# EAGLE design BT832A (EAGLE 9.6.2)

## Sheet 1 of 3
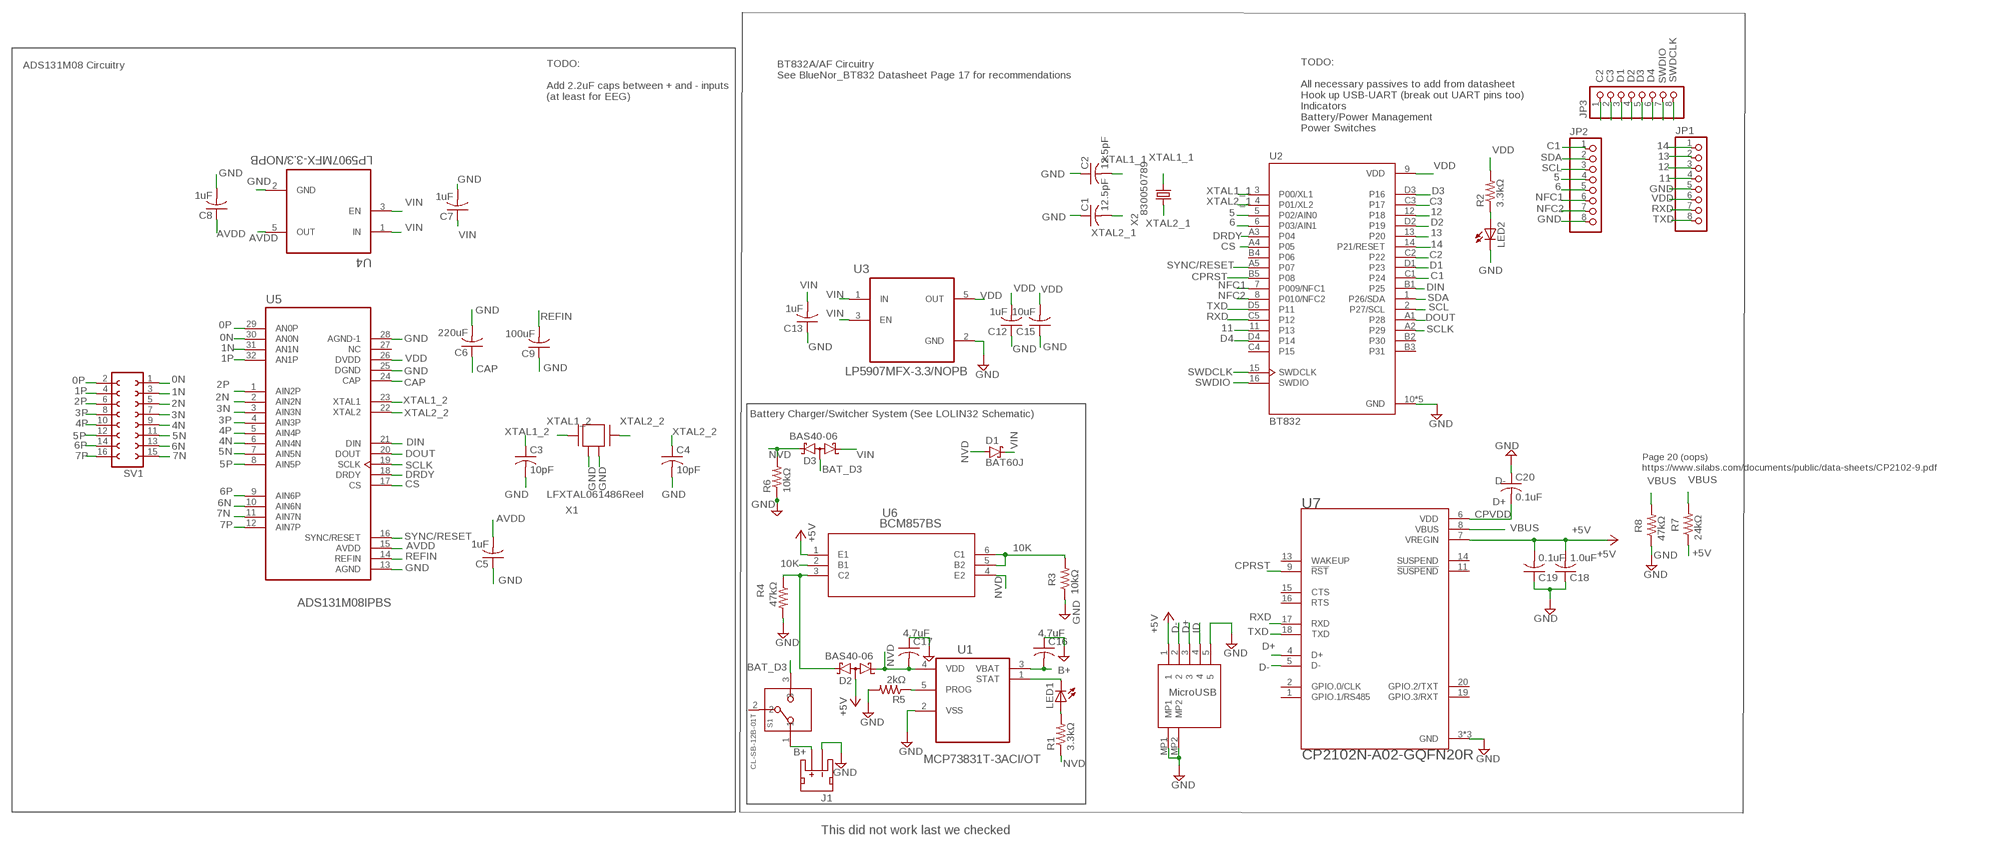
[diagram p0: schematic, sheet 1]

### Parts
C1  12.5pF  C-USC0402  [C0402]
C2  12.5pF  C-USC0402  [C0402]
C3  10pF  C-USC0402  [C0402]
C4  10pF  C-USC0402  [C0402]
C5  1uF  C-USC0402  [C0402]
C6  220uF  C-USC0402  [C0402]
C7  1uF  C-USC0402  [C0402]
C8  1uF  C-USC0402  [C0402]
C9  100uF  C-USC0402  [C0402]
C12  1uF  C-USC0402  [C0402]
C13  1uF  C-USC0402  [C0402]
C15  10uF  C-USC0402  [C0402]
C16  4.7uF  C-USC0402  [C0402]
C17  4.7uF  C-USC0402  [C0402]
C18  1.0uF  C-USC0402  [C0402]
C19  0.1uF  C-USC0402  [C0402]
C20  0.1uF  C-USC0402  [C0402]
D1  BAT60J  [SOD323_ST]
D2  BAS40-06  [SOT23]
D3  BAS40-06  [SOT23]
J1  JST_2MM_MALE  [JST-2-SMD]
JP1  PINHD-1X8CLEANBIG  [1X08-CLEANBIG]
JP2  PINHD-1X8CLEANBIG  [1X08-CLEANBIG]
JP3  PINHD-1X8CLEANBIG  [1X08-CLEANBIG]
LED1  LEDCHIP-LED0603  [CHIP-LED0603]
LED2  LEDCHIP-LED0603  [CHIP-LED0603]
R1  3.3kΩ  R-US_R0402  [R0402]
R2  3.3kΩ  R-US_R0402  [R0402]
R3  10kΩ  R-US_R0402  [R0402]
R4  47kΩ  R-US_R0402  [R0402]
R5  2kΩ  R-US_R0402  [R0402]
R6  10kΩ  R-US_R0402  [R0402]
R7  24kΩ  R-US_R0402  [R0402]
R8  47kΩ  R-US_R0402  [R0402]
S1  CL-SB-12B-01T  [CL-SB-12B]
SV1  FE08-2  [FE08-2]
U1  MCP73831T-3ACI/OT  [SOT95P270X145-5N]
U2  BT832  [BLEMODULE_BT832]
U3  LP5907MFX-3.3/NOPB  [SOT95P280X145-5N]
U4  LP5907MFX-3.3/NOPB  [SOT95P280X145-5N]
U5  ADS131M08IPBS  [QFP50P700X700X120-32N]
U6  BCM857BS  [SOT363_NEX]
U7  CP2102N-A02-GQFN20R  [SILABS_CP2102N-A02-GQFN20R]
U$1  DX4R005JJ2R1800  [DX4R005JJ2R1800]
X1  ABM3B-8.000MHZ-B2-T  [ABM3B-8.000MHZ-B2-T]
X2  FC-12M  [FC-12M]

### Nets
0N: SV1.1 U5.30(AN0N)
0P: SV1.2 U5.29(AN0P)
1N: SV1.3 U5.31(AN1N)
1P: SV1.4 U5.32(AN1P)
2N: SV1.5 U5.2(AIN2N)
2P: SV1.6 U5.1(AIN2P)
3N: SV1.7 U5.3(AIN3N)
3P: SV1.8 U5.4(AIN3P)
4N: SV1.9 U5.6(AIN4N)
4P: SV1.10 U5.5(AIN4P)
5: JP2.4 U2.5(P02/AIN0)
5N: SV1.11 U5.7(AIN5N)
5P: SV1.12 U5.8(AIN5P)
6: JP2.5 U2.6(P03/AIN1)
6N: SV1.13 U5.10(AIN6N)
6P: SV1.14 U5.9(AIN6P)
7N: SV1.15 U5.11(AIN7N)
7P: SV1.16 U5.12(AIN7P)
10K: R3.2 U6.2(B1) U6.5(B2) U6.6(C1)
11: JP1.4 U2.11(P13)
12: JP1.3 U2.12(P18)
13: JP1.2 U2.13(P20)
14: JP1.1 U2.14(P21/RESET)
+5V: C18.2 C19.2 D2.3(AA) R7.1 U6.1(E1) U7.7(VREGIN) U$1.1
AVDD: C5.2 C8.1 U4.5(OUT) U5.15(AVDD)
B+: C16.2 J1.2(+) S1.1 U1.3(VBAT)
BAT_D3: D3.3(AA) S1.3
C1: JP2.1 U2.C1(P24)
C2: JP3.1 U2.C2(P22)
C3: JP3.2 U2.C3(P17)
CAP: C6.1 U5.24(CAP)
CPRST: U2.B5(P08) U7.9(!RST)
CPVDD: C20.2 U7.6(VDD)
CS: U2.A4(P05) U5.17(CS)
D1: JP3.3 U2.D1(P23)
D2: JP3.4 U2.D2(P19)
D3: JP3.5 U2.D3(P16)
D4: JP3.6 U2.D4(P14)
D+: U7.4(D+) U$1.3
D-: U7.5(D-) U$1.2
DIN: U2.B1(P25) U5.21(DIN)
DOUT: U2.A1(P28) U5.20(DOUT)
DRDY: U2.A3(P04) U5.18(DRDY)
GND: C1.1 C2.1 C3.2 C4.2 C5.1 C6.2 C7.2 C8.2 C9.1 C12.1 C13.1 C15.1 C16.1 C17.1 C18.1 C19.1 C20.1 J1.1(-) JP1.5 JP2.8 LED2.C R3.1 R4.2 R5.2 R6.1 R8.1 U1.2(VSS) U2.10(GND) U2.A0(GND) U2.B0(GND) U2.C0(GND) U2.D0(GND) U3.2(GND) U4.2(GND) U5.13(AGND) U5.25(DGND) U5.28(AGND-1) U7.3(GND) U7.12(GND) U7.21(GND) U$1.5 U$1.MP1 U$1.MP2 X1.2 X1.4
ID: U$1.4
N$1: LED2.A R2.1
N$9: R5.1 U1.5(PROG)
N$11: LED1.A R1.2
N$14: D2.2(K2) R4.1 U6.3(C2)
N$18: LED1.C U1.1(STAT)
NFC1: JP2.6 U2.7(P009/NFC1)
NFC2: JP2.7 U2.8(P010/NFC2)
NVD: C17.2 D1.A D2.1(K1) D3.2(K2) R1.1 R6.2 U1.4(VDD) U6.4(E2)
REFIN: C9.2 U5.14(REFIN)
RXD: JP1.7 U2.C5(P12) U7.17(RXD)
SCL: JP2.3 U2.2(P27/SCL)
SCLK: U2.A2(P29) U5.19(SCLK)
SDA: JP2.2 U2.1(P26/SDA)
SWDCLK: JP3.8 U2.15(SWDCLK)
SWDIO: JP3.7 U2.16(SWDIO)
SYNC/RESET: U2.A5(P07) U5.16(SYNC/RESET)
TXD: JP1.8 U2.D5(P11) U7.18(TXD)
VBUS: R7.2 R8.2 U7.8(VBUS)
VDD: C12.2 C15.2 JP1.6 R2.2 U2.9(VDD) U3.5(OUT) U5.26(DVDD)
VIN: C7.1 C13.2 D1.C D3.1(K1) U3.1(IN) U3.3(EN) U4.1(IN) U4.3(EN)
XTAL1_1: C2.2 U2.3(P00/XL1) X2.2
XTAL1_2: C3.1 U5.23(XTAL1) X1.1
XTAL2_1: C1.2 U2.4(P01/XL2) X2.1
XTAL2_2: C4.1 U5.22(XTAL2) X1.3
Unconnected: J1.NC1(PAD1) J1.NC2(PAD2) S1.2 U2.B2(P30) U2.B3(P31) U2.B4(P06) U2.C4(P15) U5.27(NC) U7.1(GPIO.1/RS485) U7.2(GPIO.0/CLK) U7.11(!SUSPEND) U7.13(WAKEUP) U7.14(SUSPEND) U7.15(CTS) U7.16(RTS) U7.19(GPIO.3/RXT) U7.20(GPIO.2/TXT)

### Notes on the sheet
- ADS131M08 Circuitry
- BT832A/AF Circuitry
  See BlueNor_BT832 Datasheet Page 17 for recommendations
- TODO:
  
  Add 2.2uF caps between + and - inputs
  (at least for EEG)
- TODO:
  
  All necessary passives to add from datasheet
  Hook up USB-UART (break out UART pins too)
  Indicators
  Battery/Power Management
  Power Switches
- 830050789
- Battery Charger/Switcher System (See LOLIN32 Schematic)
- Page 20 (oops)
  https://www.silabs.com/documents/public/data-sheets/CP2102-9.pdf
- LFXTAL061486Reel
- MicroUSB
- This did not work last we checked

## Sheet 2 of 3

## Sheet 3 of 3

## Library data of the parts
C1-C9 C12 C13 C15-C20 = adafruit:C-US: CAPACITOR, American symbol
D1 = diode:BAT60J: Schottky barrier diode Source: www.st.com, BAT60J.pdf
D2 D3 = diode:BAS40-06: Silicon Schottky Diodes General-purpose diode for high-speed switching
J1 = SparkFun-Connectors:JST_2MM_MALE: JST 2MM MALE RA CONNECTOR Two pin, compact surface mount connector. Commonly used as a battery input connection point. We really like the solid locking feeling and high current rating on these small connectors. We use these all the time as battery connectors. Mates to single-cell LiPo batteries. Here is the connector we sell at SparkFun: JST Right Angle Connector - White <https://www.sparkfun.com/products/8612> (PRT-08612) Datasheet <http://www.sparkfun.com/datasheets/Prototyping/Connectors/JST-Horizontal.pdf> It was used on these SparkFun products: SparkFun MOSFET Power Controller <https://www.sparkfun.com/products/11214> (PRT-11214) SparkFun Battery Babysitter - LiPo Battery Manager <https://www.sparkfun.com/products/13777> (PRT-13777) And many, many others that required a lipo battery connection.; PROD_ID: CONN-11443; SF_ID: PRT-08612
JP1-JP3 = adafruit:PINHD-1X8: PIN HEADER
LED1 LED2 = adafruit:LED: LED OSRAM: - CHIPLED LG R971, LG N971, LY N971, LG Q971, LY Q971, LO R971, LY R971 LH N974, LH R974 LS Q976, LO Q976, LY Q976 LO Q996 - Hyper CHIPLED LW Q18S LB Q993, LB Q99A, LB R99A - SideLED LS A670, LO A670, LY A670, LG A670, LP A670 LB A673, LV A673, LT A673, LW A673 LH A674 LY A675 LS A676, LA A676, LO A676, LY A676, LW A676 LS A679, LY A679, LG A679 - Hyper Micro SIDELED® LS Y876, LA Y876, LO Y876, LY Y876 LT Y87S - SmartLED LW L88C, LW L88S LB L89C, LB L89S, LG L890 LS L89K, LO L89K, LY L89K LS L896, LA L896, LO L896, LY L896 - TOPLED LS T670, LO T670, LY T670, LG T670, LP T670 LSG T670, LSP T670, LSY T670, LOP T670, LYG T670 LG T671, LOG T671, LSG T671 LB T673, LV T673, LT T673, LW T673 LH T674 LS T676, LA T676, LO T676, LY T676, LB T676, LH T676, LSB T676, LW T676 LB T67C, LV T67C, LT T67C, LS T67K, LO T67K, LY T67K, LW E67C LS E67B, LA E67B, LO E67B, LY E67B, LB E67C, LV E67C, LT E67C LW T67C LS T679, LY T679, LG T679 LS T770, LO T770, LY T770, LG T770, LP T770 LB T773, LV T773, LT T773, LW T773 LH T774 LS E675, LA E675, LY E675, LS T675 LS T776, LA T776, LO T776, LY T776, LB T776 LHGB T686 LT T68C, LB T68C - Hyper Mini TOPLED® LB M676 - Mini TOPLED Santana® LG M470 LS M47K, LO M47K, LY M47K Source: http://www.osram.convergy.de/
R1-R8 = adafruit:R-US_: RESISTOR, American symbol
S1 = CL-SB-12B-01T:CL-SB-12B-01T: Check prices <https://pricing.snapeda.com/parts/CL-SB-12B-01T/Nidec%20Copal/view-part?ref=eda>; AVAILABILITY: In Stock; DESCRIPTION: Slide Switch SPDT Surface Mount; MF: Nidec Copal; MP: CL-SB-12B-01T; PACKAGE: None; PRICE: None
SV1 = con-lsta:FE08-2: FEMALE HEADER; OC_FARNELL: unknown; OC_NEWARK: unknown
U1 = MCP73831T-3ACI_OT:MCP73831T-3ACI/OT: Li-Polymer Charge Management Controllers, SOT23-5 Check prices <https://pricing.snapeda.com/parts/MCP73831T-3ACI/OT/Microchip/view-part?ref=eda>; AVAILABILITY: In Stock; DESCRIPTION: Charger IC Lithium Ion/Polymer SOT-23-5; MF: Microchip; MP: MCP73831T-3ACI/OT; PACKAGE: SOT-23-5 Microchip; PRICE: None
U2 = BT832:BT832: BLE 5 Module: Nordic nRF52832 SoC, Cortex M4F with PCB trace antenna Check prices <https://pricing.snapeda.com/parts/BT832/Fanstel%20Corp./view-part?ref=eda>; AVAILABILITY: Not in stock; DESCRIPTION: Bluetooth Bluetooth v5.0 Transceiver Module 2.4GHz Integrated, Trace Surface Mount; MF: Fanstel Corp.; MP: BT832; PACKAGE: Module Fanstel Corp.; PRICE: None
U3 U4 = LP5907MFX-3.3_NOPB:LP5907MFX-3.3/NOPB: IC REG LINEAR 3.3V 250MA SOT23; AVAILABILITY: Unavailable; DESCRIPTION: Linear Voltage Regulator IC 1 Output 250mA SOT-23-5; MF: Texas Instruments; MP: LP5907MFX-3.3/NOPB; PACKAGE: SOT-23 Texas Instruments; PRICE: None
U5 = ADS131M08IPBS:ADS131M08IPBS: None Check prices <https://pricing.snapeda.com/parts/ADS131M08IPBS/Texas%20Instruments/view-part?ref=eda>; AVAILABILITY: Warning; DESCRIPTION: 24-bit 32-kSPS 8-channelsimultaneous-sampling delta-sigma ADC 32-TQFP -40 to 125; MF: Texas Instruments; MP: ADS131M08IPBS; PACKAGE: TQFP-32 Texas Instruments; PRICE: None; PURCHASE-URL: https://pricing.snapeda.com/search/part/ADS131M08IPBS/?ref=eda
U6 = BCM857BS:BCM857BS; COPYRIGHT: Copyright (C) 2016 Accelerated Designs. All rights reserved; MANUFACTURER_PART_NUMBER: BCM857BS; SOURCELIBRARY: Nexperia_2018-05-2018; VENDOR: Nexperia
U7 = CP2102N-A02-GQFN20R:CP2102N-A02-GQFN20R: IC USB TO UART BRIDGE QFN20 Check prices <https://pricing.snapeda.com/parts/CP2102N-A02-GQFN20R/Silicon%20Labs/view-part?ref=eda>; AVAILABILITY: In Stock; DESCRIPTION: USB Bridge, USB to UART USB 2.0 UART Interface 20-QFN (3x3); MF: Silicon Labs; MP: CP2102N-A02-GQFN20R; PACKAGE: QFN-20 Silicon Labs; PRICE: None
U$1 = DX4R005JJ2R1800:DX4R005JJ2R1800: Check prices <https://pricing.snapeda.com/parts/DX4R005JJ2R1800/JAE%20Electronics/view-part?ref=eda>; AVAILABILITY: In Stock; DESCRIPTION: USB - micro B USB 2.0 Receptacle Connector 5 Position Surface Mount, Right Angle; Through Hole; MF: JAE Electronics; MP: DX4R005JJ2R1800; PACKAGE: None; PRICE: None
X1 = Crystals_Oscillators:ABM3B-8.000MHZ-B2-T: CRYSTAL 8.0000MHZ 18PF SMD Manufacturer's datasheet <https://abracon.com/Resonators/abm3b.pdf>; CREATED_BY: PCBLayout.com; DIGIKEY_PART_NUMBER: 535-9720-2-ND; MANUFACTURER: Abracon LLC; MPN: ABM3B-8.000MHZ-B2-T; PACKAGE: SMD 4
X2 = crystal:FC-12M: kHz RANGE CRYSTAL UNIT LOW PROFILE SMD Source: Epson Toyocom FC-12M.pdf

## Board
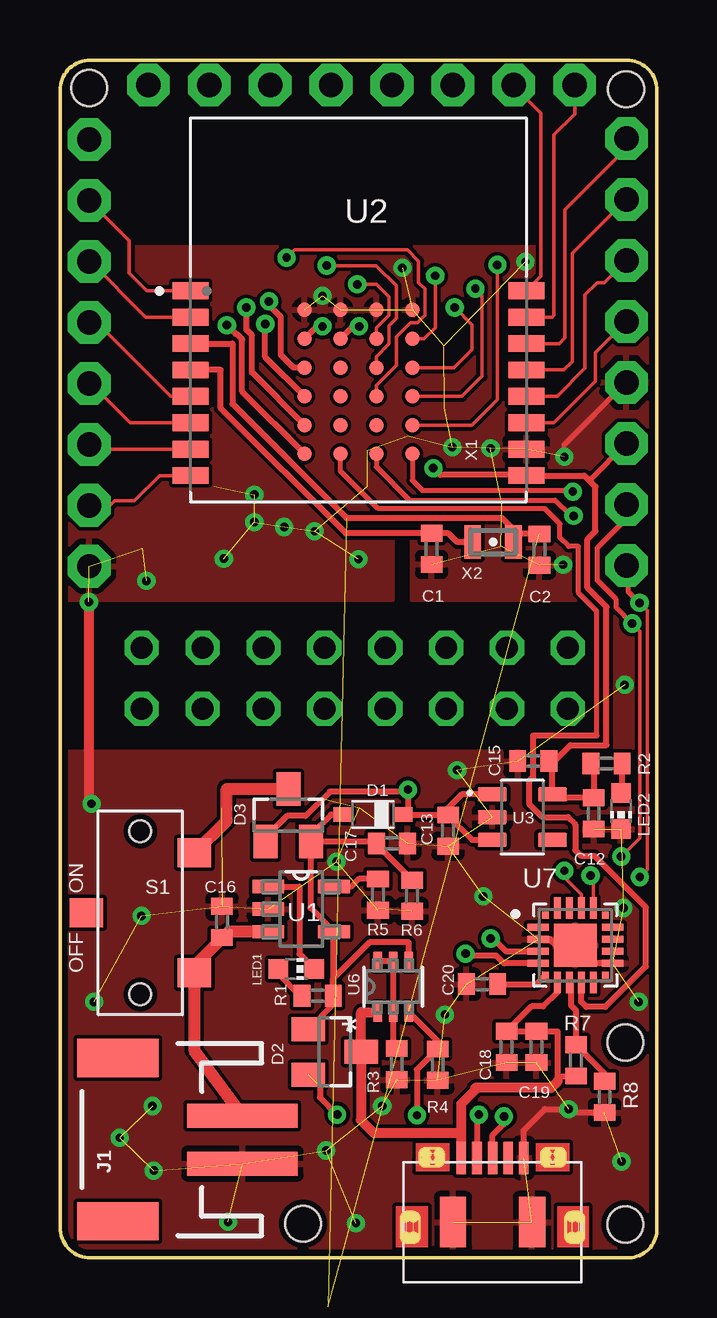
[diagram p1: board, top side]
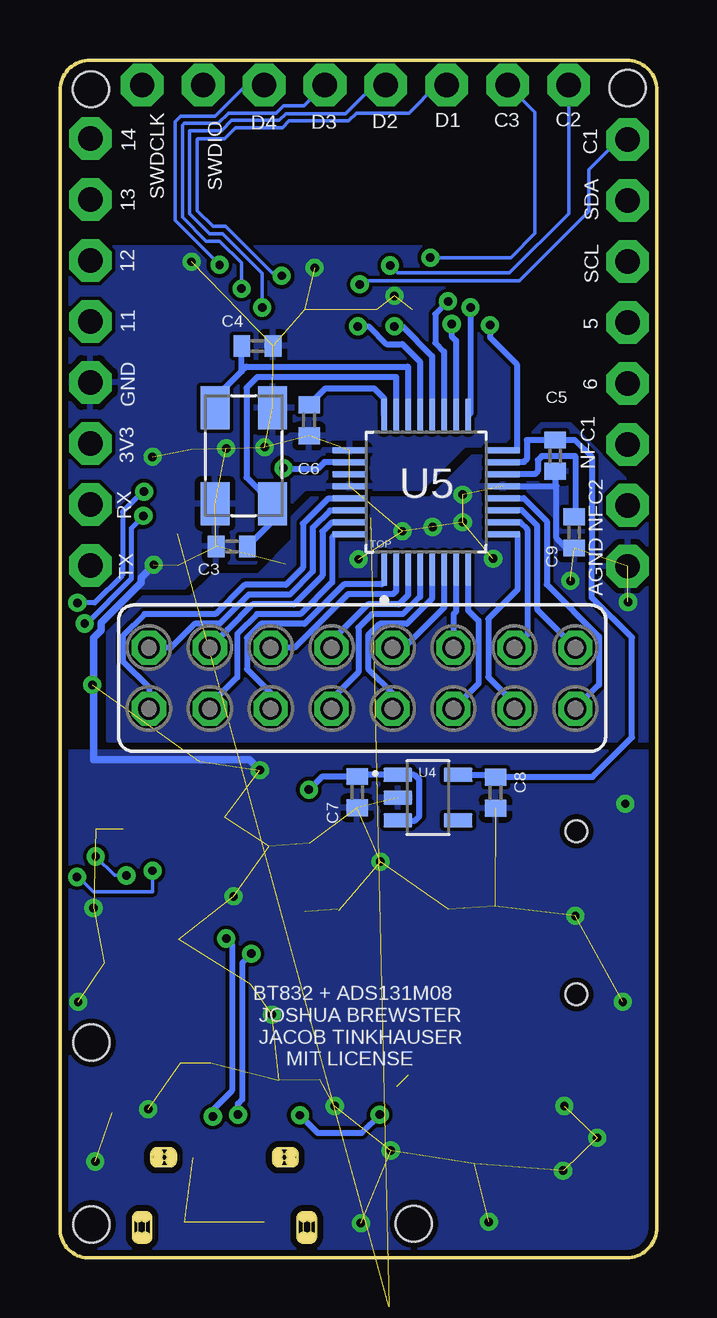
[diagram p2: board, bottom side, seen from below]

Size 24.89 x 49.91 mm. Coordinates in mm from the lower left corner, seen from the top.
Outline: 0,1.27 0,48.64 arc-90 1.27,49.91 23.62,49.91 arc-90 24.89,48.64 24.89,1.14 arc-90 23.62,0 1.27,0 arc-90 0,1.27
Outline: 14.22,0.89 14.22,1.65 arc-90 14.48,1.91 14.73,1.91 arc-90 14.99,1.65 14.99,0.89 arc-90 14.73,0.64 14.48,0.64 arc-90 14.22,0.89
Outline: 21.08,1.65 arc-90 21.34,1.91 21.59,1.91 arc-90 21.84,1.65 21.84,0.89 arc-90 21.59,0.64 21.34,0.64 arc-90 21.08,0.89 21.08,1.65
Outline: 20.32,3.81 20.83,3.81 arc90 21.08,4.06 21.08,4.32 arc90 20.83,4.57 20.32,4.57 arc90 20.07,4.32 20.07,4.06 arc90 20.32,3.81
Outline: 15.24,3.81 15.75,3.81 arc90 16,4.06 16,4.32 arc90 15.75,4.57 15.24,4.57 arc90 14.99,4.32 14.99,4.06 arc90 15.24,3.81
Copper layers (1*16): Top 0.035mm / dielectric 1.5mm / Bottom 0.035mm
Design rules "default *": minimum track width 6mil, minimum drill 0.35mm, track to track 6mil, track to pad 6mil, pad to pad 6mil, via to via 6mil, smd to smd 6mil, copper to edge 10mil, drill to drill 6mil, minimum pad ring 10mil, minimum via ring 8mil, stop-mask expansion 4mil, vias tented up to drill 0mil, thermal gap 10mil
Holes 1.5 mm at 23.6,48.69 1.22,48.74 23.57,1.4 10.13,1.42 23.57,8.97

### Footprints (pad centres in the part's own frame; a part is rotated, then mirrored left to right if it is on the bottom)
C0402 = smd 0.7 x 0.9: 1 -0.65,0; 2 0.65,0
SOD323_ST = smd 0.8 x 0.6: A 1.25,0; C -1.25,0
SOT23 = smd 1 x 1.4: 1 -0.95,-1.1; 2 0.95,-1.1; 3 0,1.1
JST-2-SMD = smd 1 x 4.6: 1 -1,-3.7; 2 1,-3.7 | smd 1.6 x 3.4: NC1 -3.4,1.5; NC2 3.4,1.5
1X08-CLEANBIG = drill 1.016 pad 1.778 octagon: 1 -8.89,0; 2 -6.35,0; 3 -3.81,0; 4 -1.27,0; 5 1.27,0; 6 3.81,0; 7 6.35,0; 8 8.89,0
CHIP-LED0603 = smd 0.8 x 0.8: A 0,-0.75; C 0,0.75
R0402 = smd 0.7 x 0.9: 1 -0.65,0; 2 0.65,0
CL-SB-12B = smd 1.2 x 1.4: 1 -2.5,-2.25; 2 0,2.25; 3 2.5,-2.25 | hole 0.9: 3.4,0; -3.4,0
FE08-2 = drill 0.914 octagon: 1 -8.89,1.27; 2 -8.89,-1.27; 3 -6.35,1.27; 4 -6.35,-1.27; 5 -3.81,1.27; 6 -3.81,-1.27; 7 -1.27,1.27; 8 -1.27,-1.27; 9 1.27,1.27; 10 1.27,-1.27; 11 3.81,1.27; 12 3.81,-1.27; 13 6.35,1.27; 14 6.35,-1.27; 15 8.89,1.27; 16 8.89,-1.27
SOT95P270X145-5N = smd 1.321 x 0.559: 1 -1.372,0.94; 2 -1.372,0; 3 -1.372,-0.94; 4 1.372,-0.94; 5 1.372,0.94
BLEMODULE_BT832 = smd 1.5 x 0.7: 1 -7,0.8; 2 -7,-0.3; 3 -7,-1.4; 4 -7,-2.5; 5 -7,-3.6; 6 -7,-4.7; 7 -7,-5.8; 8 -7,-6.9; 9 7,-6.9; 10 7,-5.8; 11 7,-4.7; 12 7,-3.6; 13 7,-2.5; 14 7,-1.4; 15 7,-0.3; 16 7,0.8 | smd 0.6 x 0.6: A0 -2.25,0; A1 -2.25,-1.2; A2 -2.25,-2.4; A3 -2.25,-3.6; A4 -2.25,-4.8; A5 -2.25,-6; B0 -0.75,0; B1 -0.75,-1.2; B2 -0.75,-2.4; B3 -0.75,-3.6; B4 -0.75,-4.8; B5 -0.75,-6; C0 0.75,0; C1 0.75,-1.2; C2 0.75,-2.4; C3 0.75,-3.6; C4 0.75,-4.8; C5 0.75,-6; D0 2.25,0; D1 2.25,-1.2; D2 2.25,-2.4; D3 2.25,-3.6; D4 2.25,-4.8; D5 2.25,-6
SOT95P280X145-5N = smd 1.21 x 0.59: 1 -1.255,0.95; 2 -1.255,0; 3 -1.255,-0.95; 4 1.255,-0.95; 5 1.255,0.95
QFP50P700X700X120-32N = smd 1.44 x 0.26: 1 -3.195,1.75; 2 -3.195,1.25; 3 -3.195,0.75; 4 -3.195,0.25; 5 -3.195,-0.25; 6 -3.195,-0.75; 7 -3.195,-1.25; 8 -3.195,-1.75; 17 3.195,-1.75; 18 3.195,-1.25; 19 3.195,-0.75; 20 3.195,-0.25; 21 3.195,0.25; 22 3.195,0.75; 23 3.195,1.25; 24 3.195,1.75 | smd 0.26 x 1.44: 9 -1.75,-3.195; 10 -1.25,-3.195; 11 -0.75,-3.195; 12 -0.25,-3.195; 13 0.25,-3.195; 14 0.75,-3.195; 15 1.25,-3.195; 16 1.75,-3.195; 25 1.75,3.195; 26 1.25,3.195; 27 0.75,3.195; 28 0.25,3.195; 29 -0.25,3.195; 30 -0.75,3.195; 31 -1.25,3.195; 32 -1.75,3.195
SOT363_NEX = smd 0.787 x 0.356: 1 -1.067,0.65; 2 -1.067,0; 3 -1.067,-0.65; 4 1.067,-0.65; 5 1.067,0; 6 1.067,0.65
SILABS_CP2102N-A02-GQFN20R = smd 0.3 x 0.3: 1 -1.25,1.25; 6 -1.25,-1.25; 11 1.25,-1.25; 16 1.25,1.25 | smd 0.9 x 0.3: 2 -1.55,0.75; 3 -1.55,0.25; 4 -1.55,-0.25; 5 -1.55,-0.75; 12 1.55,-0.75; 13 1.55,-0.25; 14 1.55,0.25; 15 1.55,0.75 | smd 0.3 x 0.9: 7 -0.75,-1.55; 8 -0.25,-1.55; 9 0.25,-1.55; 10 0.75,-1.55; 17 0.75,1.55; 18 0.25,1.55; 19 -0.25,1.55; 20 -0.75,1.55 | smd 1.8 x 1.8: 21 0,0
DX4R005JJ2R1800 = smd 1.35 x 0.4: 1 1.525,1.3; 2 1.525,0.65; 3 1.525,0; 4 1.525,-0.65; 5 1.525,-1.3 | smd 2.1 x 1.1: MP1 -1.15,1.65; MP2 -1.15,-1.65
ABM3B-8.000MHZ-B2-T = smd 1.8 x 1.2: 1 -2,-1.2; 2 2,-1.2; 3 2,1.2; 4 -2,1.2
FC-12M = smd 0.7 x 1.4: 1 -0.85,0; 2 0.85,0

### Placement (x,y rotation side)
C1  15.49,29.54 90 top
C2  19.99,29.52 90 top
C3  17.73,29.64 180 bottom
C4  16.66,38 0 bottom
C5  4.24,33.43 90 bottom
C6  14.5,34.9 270 bottom
C7  12.5,19.41 270 bottom
C8  6.73,19.38 270 bottom
C9  3.45,30.23 90 bottom
C12  22.25,18.52 90 top
C13  16.18,17.81 90 top
C15  19.74,20.7 0 top
C16  6.76,14 270 top
C17  13.84,17.27 180 top
C18  18.62,8.79 90 top
C19  19.86,8.79 90 top
C20  17.6,11.41 0 top
D1  13.06,18.47 180 top
D2  11.46,8.59 270 top
D3  9.53,18.44 0 top
J1  3.91,4.93 90 top
JP1  23.62,37.75 270 top
JP2  1.22,37.71 270 top
JP3  12.57,48.87 0 top
LED1  9.86,12.04 270 top
LED2  23.39,18.62 180 top
R1  10.74,10.92 180 top
R2  22.78,20.6 180 top
R3  14.05,8.08 90 top
R4  15.75,8.05 270 top
R5  13.26,15.14 270 top
R6  14.68,15.09 90 top
R7  21.51,8.23 90 top
R8  22.71,6.71 90 top
S1  3.35,14.38 90 top
SV1  12.29,24.16 0 bottom
U1  10.06,14.53 0 top
U2  12.45,39.5 0 top
U3  19.28,18.36 0 top
U4  9.55,19.18 0 bottom
U5  9.63,31.9 90 bottom
U6  13.89,11.3 90 top
U7  21.49,13.03 0 top
U$1  18.03,2.64 90 top
X1  17.22,33.43 90 bottom
X2  18.06,29.82 0 top

### Tracks (layer width: path | path; a pad name or v marks a point on that pad's centre or on a via)
0N
  Bottom 0.254: U5.30 12.84,31.14 13.64,31.14 14.35,30.42 14.35,28.59 15.31,27.64 17.02,27.64 18.24,26.42 19.28,26.42 20.27,25.43 SV1.1
0P
  Bottom 0.254: U5.29 12.84,31.64 13.71,31.64 14.76,30.59 14.76,28.76 15.47,28.04 17.19,28.04 18.41,26.82 21.37,26.82 22.28,25.91 22.28,24.86 21.18,23.77 SV1.2
1N
  Bottom 0.254: U5.31 12.84,30.64 13.56,30.64 13.94,30.26 13.94,28.42 15.14,27.23 16.85,27.23 17.91,26.17 17.91,26.16 SV1.3
1P
  Bottom 0.254: U5.32 13.41,30.15 13.54,30.02 13.54,28.15 14.87,26.82 16.68,26.82 17.5,26 17.5,24.19 18.64,23.04 SV1.4
2N
  Bottom 0.254: U5.2 10.88,27.78 11,27.66 12.88,27.66 15.11,25.43 SV1.5
2P
  Bottom 0.254: SV1.6 16.1,23.54 17.09,24.53 17.09,25.84 16.51,26.42 14.7,26.42 13.05,28.06 11.48,28.06 11.38,28.17 U5.1
3N
  Bottom 0.254: U5.3 10.38,27.62 10.77,27.23 12.05,27.23 13.56,25.72 SV1.7
3P
  Bottom 0.254: U5.4 9.88,27.54 10.6,26.82 11.88,26.82 12.45,26.26 12.45,24.39 13.56,23.27 SV1.8
4N
  Bottom 0.254: SV1.9 10.54,25.43 8.88,27.09 U5.6
4P
  Bottom 0.254: U5.5 9.38,27.47 10.43,26.42 11.56,26.42 12.04,25.94 12.04,24.53 11.02,23.52 SV1.10
5
  Top 0.152: U2.5 4.62,35.9 1.54,38.98 JP2.4
5N
  Bottom 0.254: U5.7 8.38,26.93 8.48,26.82 SV1.11
5P
  Bottom 0.254: U5.8 7.88,26.98 7.44,26.55 7.44,23.93 SV1.12
6
  Top 0.152: U2.6 2.92,34.8 1.28,36.44 JP2.5
6N
  Bottom 0.254: U5.10 5.71,30.65 5.41,30.36 5.41,25.96 SV1.13
6P
  Bottom 0.254: U5.9 5.82,30.15 5.82,27.84 7.04,26.62 7.04,24.2 5.94,23.11 SV1.14
7N
  Bottom 0.254: U5.11 6.42,31.16 5.64,31.16 5,30.52 5,27.03 SV1.15
7P
  Bottom 0.254: U5.12 5.56,31.65 4.6,30.69 4.6,28.07 2.41,25.88 2.41,23.88 SV1.16
10K
  Top 0.254: U6.6 U6.5 U6.2 13.89,8.88 R3.2
11
  Top 0.152: U2.11 20.6,34.8 22.33,36.53 22.33,37.72 JP1.4
12
  Top 0.152: U2.12 20.73,35.9 21.89,37.06 21.89,40.13 22.4,40.64 22.71,40.64 JP1.3
13
  Top 0.152: U2.13 21.02,37 21.36,37.34 21.36,41.86 23.6,44.1 JP1.2
14
  Top 0.152: U2.14 20.82,38.1 21.06,38.33 21.06,43.66 23.62,46.23 JP1.1
+5V
  Top 0.254: 20.75,7.37 20.75,7.54 | 20.75,7.54 20.75,9.42 20.74,9.44 C19.2 C18.2 19.66,10.48 20.14,10.48 20.74,11.08 U7.7 | R7.1 21.48,7.54 20.75,7.54
  Top 0.406: U6.1 12.56,10.24 D2.3 12.55,5.74 13.08,5.21 16.73,5.21 | U$1.1 16.73,5.21 | 16.73,5.21 16.73,6.41 17.41,7.09 | 20.75,7.37 20.47,7.09 17.41,7.09 | 17.41,7.09 17.31,7.09
AVDD
  Bottom 0.254: U4.5 6.83,20.13 C8.1 2.69,20.04 1.04,21.69 1.04,25.86 2.72,27.52 2.72,28.7 | 2.72,28.7 2.72,33.37 3.43,34.08 C5.2 5.43,34.08 5.43,33.27 5.54,33.17 6.42,33.17 U5.15 | 2.72,28.7
B+
  Top 0.152: C16.2 6.76,13.31
  Top 0.508: J1.2 5.6,8.65 S1.1 5.6,12.16 6.76,13.31 7.04,13.59 U1.3
BAT_D3
  Top 0.508: S1.3 6.95,18.22 6.95,19.54 D3.3
C1  (via drill 0.35)
  Top 0.152: U2.C1 13.2,38.75 13.72,39.28 13.72,40.05 13.21,40.56 v12.4,40.56
  Bottom 0.152: v12.4,40.56 12.24,40.72 5.74,40.72 2.84,43.61 2.84,45.34 1.59,46.6 JP2.1
C2  (via drill 0.35)
  Top 0.152: U2.C2 13.2,37.55 13.72,38.08 13.72,38.85 14.03,39.15 14.03,40.5 13.18,41.35 v11.13,41.35
  Bottom 0.152: v11.13,41.35 10.82,41.04 6.15,41.04 3.68,43.51 JP3.1
C3  (via drill 0.35)
  Top 0.152: U2.C3 13.2,36.35 14.03,37.18 14.03,38.38 14.62,38.97 14.91,38.97 15.22,39.28 15.22,40.37 14.96,40.64 14.96,41.53 14.48,42.01 9.78,42.01 v9.45,41.68
  Bottom 0.152: v9.45,41.68 6.1,41.68 5.08,42.69 5.08,47.73 JP3.2
CAP
  Bottom 0.254: U5.24 11.38,35.81 11.79,36.22 13.83,36.22 C6.1
CPRST
  Top 0.203: 22.38,21.77 22.38,26.95 21.62,27.71 21.62,29.64 21.21,29.64 20.85,30 20.85,30.58 20.21,31.22 13.26,31.22 11.7,32.79 11.7,33.38
  Top 0.254: 11.8,33.5 U2.B5 11.7,33.38 | 22.38,21.77 19.74,21.77 19.74,20.04 19.56,19.86 19.56,18.92 20.12,18.36 21.18,18.36 21.49,18.06 21.49,16.99 21.74,16.74 22.3,16.74 24.43,14.61 24.43,12.14 22.75,10.46 21.95,10.46 21.74,10.66 U7.9
CPVDD
  Top 0.254: C20.2 19.86,11.41 U7.6
CS  (via drill 0.35)
  Top 0.254: U2.A4 8,36.89 8,38.43 7.77,38.66 v7.77,39.6
  Bottom 0.254: v7.77,39.6 7.77,35.2 U5.17
D1  (via drill 0.35)
  Top 0.152: U2.D1 15.18,38.3 15.65,38.77 v15.65,40.92
  Bottom 0.152: v15.65,40.92 15.93,40.92 17.98,42.98 18.52,42.98 19.18,43.64 19.18,46.61 19.15,46.64 18.03,46.64 17.58,47.09 15.62,47.09 15.34,47.37 12.85,47.37 12.52,47.7 10.34,47.7 9.17,48.87 JP3.3
D2  (via drill 0.35)
  Top 0.152: U2.D2 16.42,37.1 17.17,37.85 17.17,38.89 v16.46,39.6
  Bottom 0.152: v16.46,39.6 16.46,41.02 18.11,42.67 18.64,42.67 19.48,43.51 19.48,46.97 18.16,46.97 17.73,47.4 15.75,47.4 15.47,47.68 12.98,47.68 11.79,48.87 JP3.4
D3  (via drill 0.35)
  Top 0.152: U2.D3 16.77,35.9 17.6,36.73 17.6,40.11 v17.32,40.39
  Bottom 0.152: JP3.5 14.71,48.01 15.57,48.01 15.87,47.7 17.86,47.7 18.29,47.27 19.71,47.27 19.79,47.19 19.79,43.36 18.8,42.37 18.24,42.37 17.32,41.45 v17.32,40.39
D4  (via drill 0.35)
  Top 0.152: U2.D4 17.17,34.7 18.24,35.76 v18.24,41.38
  Bottom 0.152: v18.24,41.38 20.09,43.23 20.09,47.35 19.86,47.57 18.41,47.57 17.12,48.87 JP3.6
D+  (via drill 0.35)
  Top 0.254: U$1.3 18.03,5.11 18.49,5.56 18.49,5.87 v18.52,5.89 | v17.96,13.31 18.06,13.31 18.59,12.78 U7.4
  Bottom 0.254: v17.96,13.31 17.72,13.07 17.72,6.97 18.52,6.17 v18.52,5.89
D-  (via drill 0.35)
  Top 0.254: U$1.2 17.39,5.89 v17.47,5.97 | v16.91,12.68 16.99,12.6 18.2,12.6 18.52,12.28 U7.5
  Bottom 0.254: v16.91,12.68 17.29,12.3 17.29,6.6 17.47,6.43 v17.47,5.97
DIN  (via drill 0.35)
  Top 0.254: v12.47,38.81 12.21,38.81 U2.B1
  Bottom 0.254: v12.47,38.81 12.01,38.81 11.28,38.08 10.62,38.08 9.88,37.33 U5.21
DOUT  (via drill 0.35)
  Top 0.254: U2.A1 10.71,38.81 v10.95,38.81
  Bottom 0.254: v10.95,38.81 10.62,38.81 9.38,37.57 U5.20
DRDY  (via drill 0.35)
  Top 0.254: U2.A3 8.56,37.53 v8.56,38.91
  Bottom 0.254: v8.56,38.91 8.56,38.41 8.38,38.22 U5.18
GND  (via drill 0.35)  (69 unrouted)
  Top 0.203: v21.03,33.38 21.03,33.88 JP1.5
  Top 0.254: R5.2 13.31,14.54 | U$1.5 19.33,5.31 20.22,6.2 v21.21,6.2 21.35,6.06 R8.1 | U7.12 22.24,12.28 U7.21 20.68,13.03 20.43,13.29 U7.3
  Top 0.406: v1.21,27.33 1.19,27.32 1.19,19.05 v1.32,18.92
  Bottom 0.254: U5.13 4.24,32.15 | 4.24,32.15 4.19,32.15 4.19,29.99 3.77,29.58 C9.1 | C5.1 4.24,32.15
  Bottom 0.305: v20.98,28.88 21.52,28.34 21.52,28.12 23.18,26.46 23.18,26.15 23.49,25.83 23.49,20.75 16.99,20.75 v16.56,20.32
  other vias: 1.42,10.67 2.49,5 7.01,1.5 11.1,4.47 10.62,30.28 9.35,30.46 8.1,30.66 8.1,31.8 6.83,29.13 12.45,29.11 3.61,28.21 16.05,10.14 13.44,6.33 16.36,33.78 14.27,41.25 10.95,40.08 19.41,41.5 12.34,1.45 3.4,14.25 24.13,10.67 23.42,4.01 11.53,16.51 3.91,3.63 17.96,33.73 23.55,23.88 3.86,6.33 17.65,15.06 23.5,14.58
  pour Bottom: 0,21.11 24.89,21.11 24.89,0 0,0
  pour Bottom: 0,21.54 22.91,21.54 22.91,26.06 21.44,27.53 19.46,27.53 18.52,28.47 16.64,28.47 15.19,29.92 15.19,30.89 14.43,31.65 9.47,31.65 7.72,33.4 6.17,33.4 4.83,34.75 3.61,34.75 0,31.14
  pour Bottom: 0,31.98 3.3,35.28 5.03,35.28 6.48,33.83 8,33.83 9.8,32.03 14.68,32.03 15.6,31.12 15.6,30.1 16.74,28.96 18.64,28.96 19.69,27.92 24.89,27.92 24.89,42.14 0,42.14
  pour Top: 0,0 0,21.11 22.05,21.11 22.56,21.62 22.56,27.41 14.66,27.41 14.66,30.02 13.89,30.02 13.89,27.41 0,27.41 0,42.14 24.89,42.14 24.89,0
N$1
  Top 0.254: LED2.A 23.39,19.49 23.43,19.53 R2.1
N$9
  Top 0.254: R5.1 12.47,15.79 12.15,15.47 U1.5
N$11
  Top 0.254: LED1.A 9.11,11.81 9.99,10.92 R1.2
N$14  (via drill 0.35)  (1 unrouted)
  Top 0.254: U6.3 15.8,8.98 15.8,8.75 R4.1 14.88,7.84 v14.88,5.94 | 10.84,7.15 10.84,6.69 v11.56,5.97
  Bottom 0.254: v11.56,5.97 12.32,5.21 14.15,5.21 v14.88,5.94
N$18
  Top 0.254: U1.1 9.98,15.47 9.98,12.66 LED1.C
NFC1
  Top 0.152: U2.7 2.09,33.7 1.89,33.9 JP2.6
NFC2
  Top 0.152: U2.8 4.15,32.6 3.1,31.55 2.29,31.55 2.1,31.36 JP2.7
NVD
  Top 0.254: D1.A 11.3,18.47 10.47,17.65 D3.2 | R6.2 14.68,15.75 13.16,17.27 | D3.2 13.09,17.34 13.16,17.27 | R1.1 11.39,13.55 U1.4 10.44,14.58 10.44,17.31 D3.2 | D2.1 11.39,10.57 R1.1 | U6.4 14.54,13.15 12.91,13.15 11.39,11.63 R1.1 | C17.2 13.16,17.27
REFIN
  Bottom 0.254: 3.55,30.98 C9.2 3.4,30.93 3.4,33.41 4.81,33.41 4.97,33.24 4.97,32.78 5.1,32.65 U5.14
RXD  (via drill 0.35)
  Top 0.152: v23.86,26.43 24.17,26.12 24.17,17.49 v23.4,16.72 | U7.17 22.24,15.93 v22.12,15.93
  Top 0.203: U2.C5 13.2,32.96 14.58,31.58 20.64,31.58 21.3,30.92 v21.41,30.92 | v23.86,26.43 23.19,27.1 23.19,27.44 22.4,28.23 22.4,29.58 23.62,30.8 JP1.7
  Bottom 0.152: v23.4,16.72 22.61,15.93 v22.12,15.93
  Bottom 0.203: v23.86,26.43 23.78,26.43 21.92,28.29 21.92,30.41 v21.41,30.92
SCL
  Top 0.152: U2.2 3.58,39.2 1.26,41.52 JP2.3
SCLK  (via drill 0.35)
  Top 0.254: v8.71,39.85 8.71,39.69 9.22,39.19 9.22,37.62 9.74,37.1 U2.A2
  Bottom 0.254: v8.71,39.85 9.25,39.32 9.25,38.13 8.88,37.76 U5.19
SDA
  Top 0.152: U2.1 3.62,40.3 2.9,41.02 2.9,42.38 JP2.2
SWDCLK
  Top 0.152: U2.15 20.53,39.2 20.6,39.27 20.6,46.79 21.46,47.65 JP3.8
SWDIO
  Top 0.152: U2.16 20.06,40.91 20.06,47.69 18.92,48.82 JP3.7
SYNC/RESET  (via drill 0.35)
  Top 0.254: U2.A5 7.59,36.1 7.59,38.27 7.36,38.5 7.32,38.5 v6.96,38.86
  Bottom 0.254: v6.96,38.86 6.96,38.35 5.85,37.24 5.85,33.65 U5.16
TXD  (via drill 0.35)
  Top 0.152: v24.17,27.29 24.48,26.98 24.48,16.17 v24.18,15.87 | v21.03,16.13 21.03,15.86 21.74,15.16 U7.18
  Top 0.203: U2.D5 14.7,32.4 15.11,31.98 21.18,31.98 | 21.18,31.98 | 21.18,31.98 21.38,31.98 21.39,31.98 v21.39,31.93 | v24.17,27.29 23.69,27.77 23.69,28.79 JP1.8
  Bottom 0.152: v24.18,15.87 24.12,15.87 23.52,15.26 21.03,15.26 v21.03,16.13
  Bottom 0.203: v21.39,31.93 21.44,31.93 22.29,31.08 22.29,28.45 23.44,27.29 v24.17,27.29
VBUS
  Top 0.254: U7.8 21.31,11.41 21.31,10.52 21.51,10.31 R7.2 22.71,7.69 R8.2
VDD  (via drill 0.35)
  Top 0.152: 19.41,32.63 U2.9 | C15.2 20.48,20.61 20.53,20.61
  Top 0.203: JP1.6 22.09,32.4 22.06,32.4
  Top 0.254: R2.2 22.25,20.48 C12.2 20.68,19.17 U3.5 20.53,20.61 21.29,21.36 22.78,21.36 22.78,27.13 22,27.92 22,29.95 22.33,30.28 22.33,32.13 22.06,32.4 21.86,32.6 U2.9 | 19.41,32.63 15.85,32.63 v15.57,32.91
  Bottom 0.152: 15.54,32.88 v15.57,32.91
  Bottom 0.254: U5.26 13.86,33.15 14.13,32.88 15.54,32.88
VIN  (via drill 0.35)
  Top 0.254: C13.2 16.18,18.47 D1.C 14.51,18.67 v14.51,19.51 14.43,19.43 11.25,19.43 10.24,18.42 9.47,18.42 8.57,17.53 D3.1 | U3.1 16.75,19.31 16.18,18.74 C13.2 | C13.2 16.18,18.43 17.2,17.41 U3.3
  Bottom 0.254: U4.3 10.09,18.22 9.91,18.4 9.91,19.91 10.12,20.13 U4.1 12.43,20.13 C7.1 13.96,20.06 v14.51,19.51
XTAL1_1  (2 unrouted)
  Top 0.254: U2.3 7.19,38.1 7.19,35.59 11.94,30.84 18.43,30.84 19.1,30.17 C2.2
XTAL1_2
  Bottom 0.254: U5.23 10.88,36.7 16.66,36.7 17.11,36.25 17.11,32.52 X1.1 15.94,31.35 15.94,30.78 C3.1
XTAL2_1
  Top 0.254: U2.4 6.71,37 6.71,35.41 11.92,30.19 C1.2 16.2,30.19 16.57,29.82 X2.1
XTAL2_2
  Bottom 0.254: U5.22 10.38,37.12 10.39,37.14 17.12,37.14 17.31,36.94 | X1.3 18.42,35.83 17.31,36.94 | 17.31,36.94 C4.1

### Text on the board
tPlace: OFF ON | S1
bPlace: C2 | C3 | D1 | D2 | D3 | D4 | C1 | 14 | SDA | SWDIO | SWDCLK | 13 | SCL | 12 | 5 | 11 | 6 | GND | NFC1 | 3V3 | NFC2 | RX | TOP | TX | AGND | BT832 + ADS131M08 / JOSHUA BREWSTER / JACOB TINKHAUSER / MIT LICENSE
Measures: Notes: / - Minimize space without jeopardizing grounding for the external ADC / i.e. be keen with ground plane traces and electron flow. / - Break out all unused programmable pins plus ADC inputs. / ADC inputs may have to be a (CHEAP) SMT connector backside to minimize possible interference from the radio, / but let's just break them out first and test. Let's still ID a 16-20 pin connector.